# Altium schematic sheet [6] AnalogChannels_5_6_7_8.SchDoc: =DocumentName
size A3; Organization: ORGANIZATION; Address1: R. Aprígio Veloso, 882, Universitário; Address2: Campina Grande - PB; Address3: 58429-900; DocumentNumber: 6; Revision: -; SheetNumber: 6; SheetTotal: 8; ENG_DATE: --/--/--; DSN_DATE: --/--/--; CHK_DATE: --/--/--; SCH_SCALE: 1:1
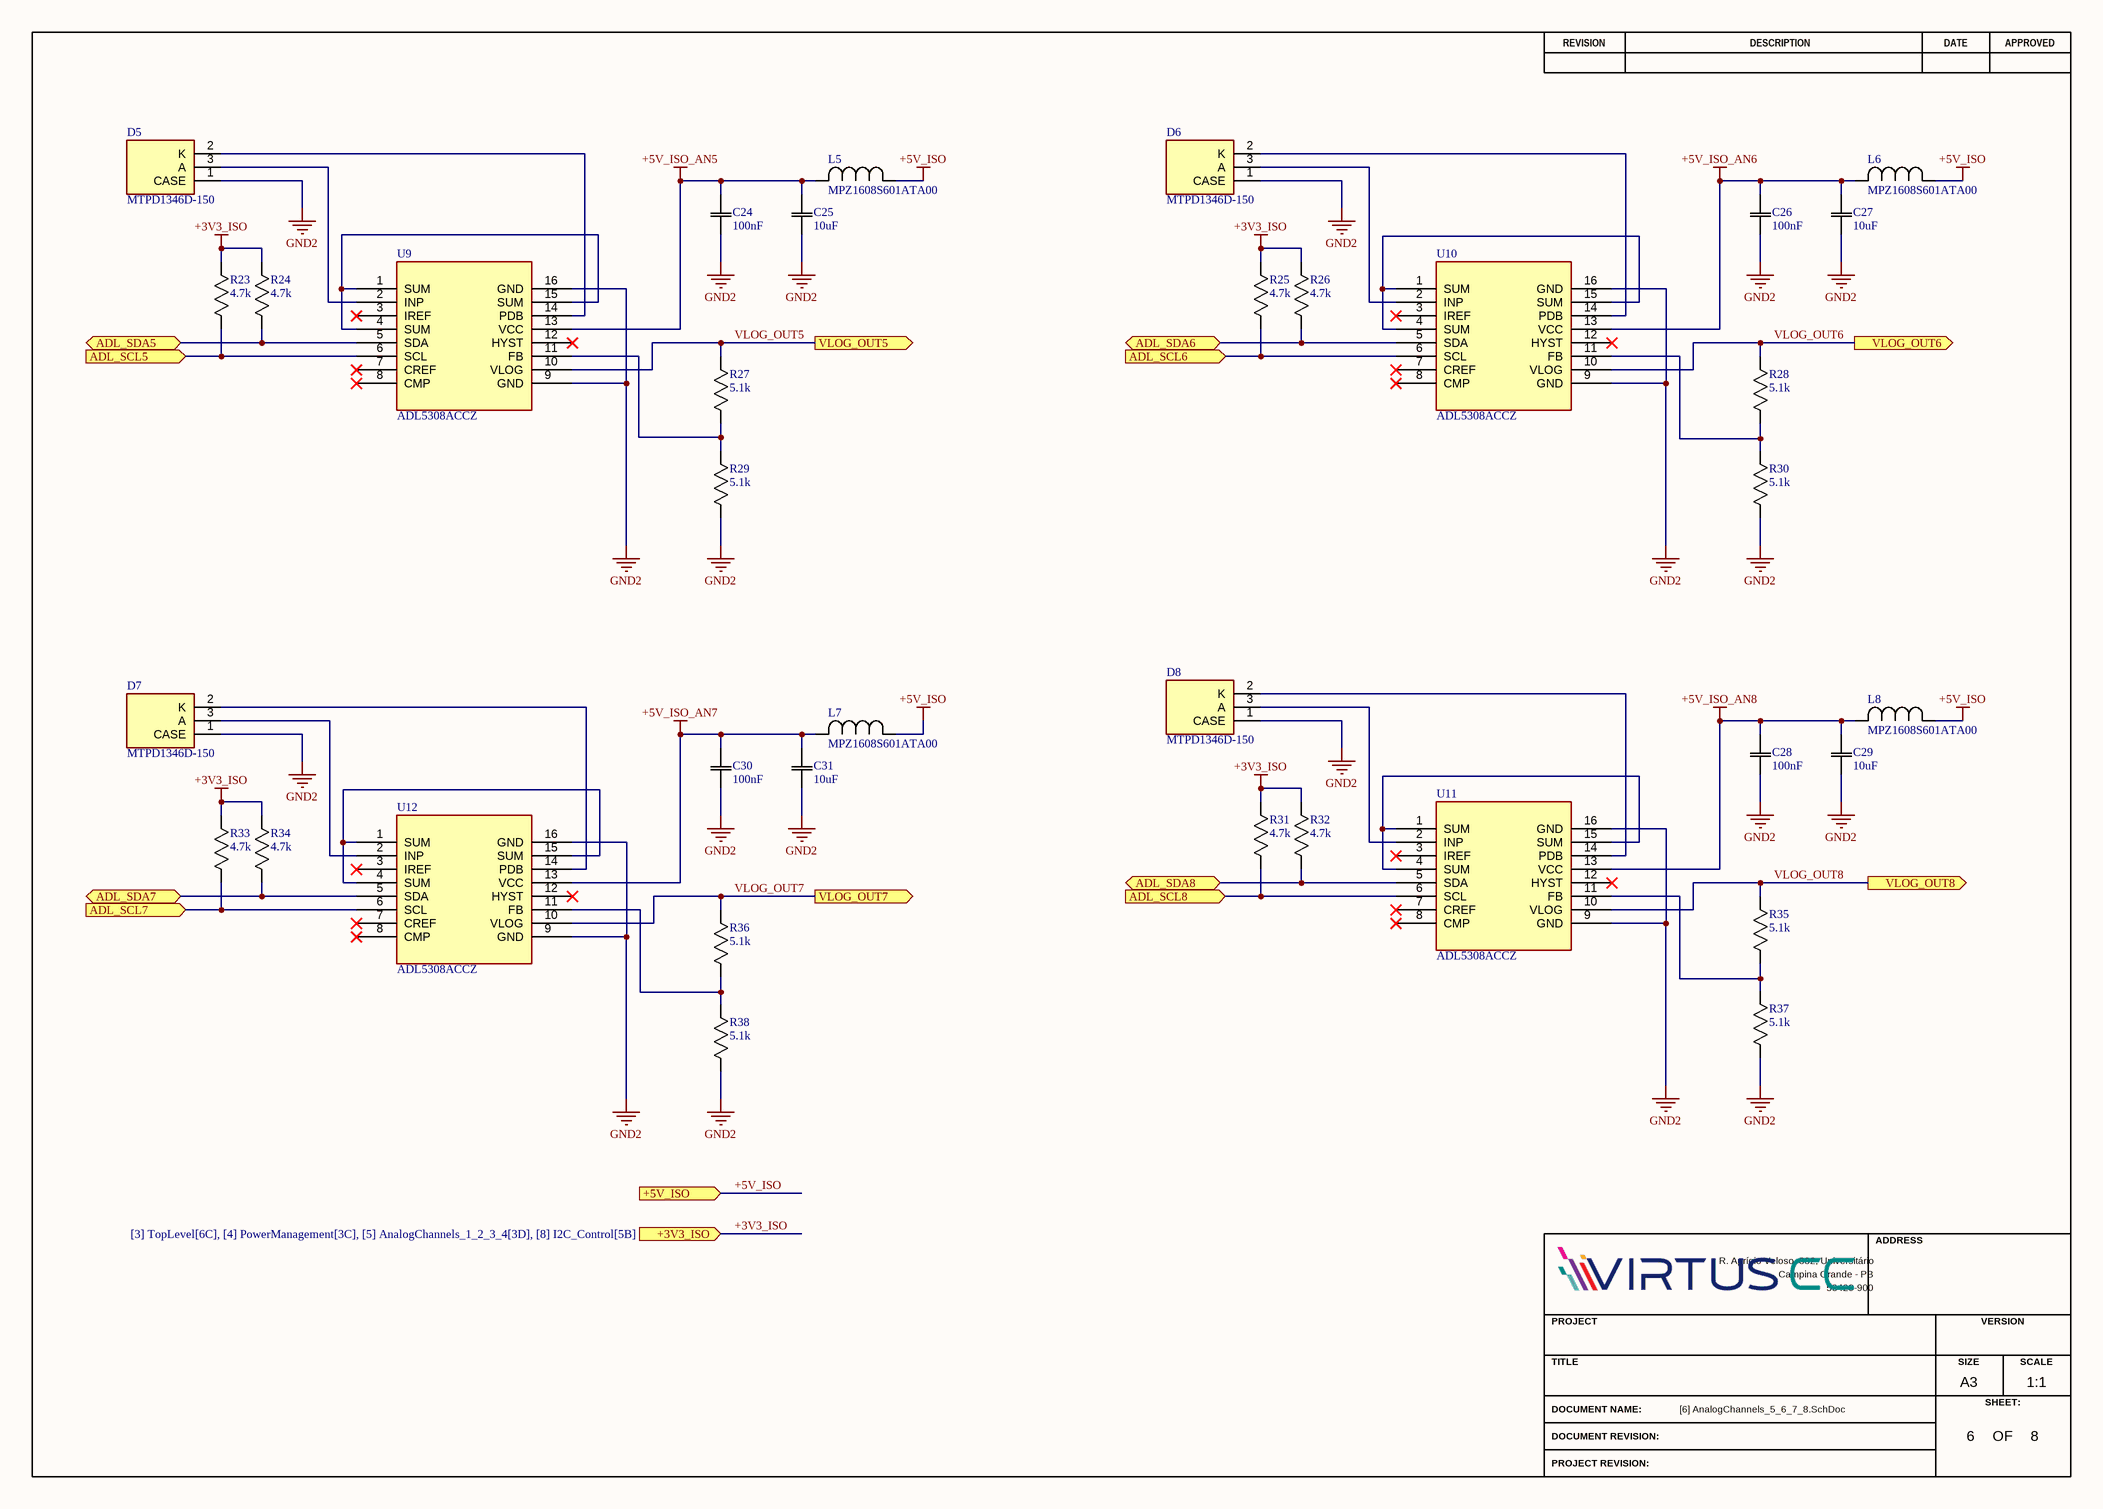
[diagram p0: [6] AnalogChannels_5_6_7_8.SchDoc]

## Parts
C24  value 100nF  [CAPC1005X40N]  (hidden comment: GCM155R71H104KE02D)
C25  value 10uF  [CAPC1005X40N]  (hidden comment: GRT155R61A106ME13D)
C26  value 100nF  [CAPC1005X40N]  (hidden comment: GCM155R71H104KE02D)
C27  value 10uF  [CAPC1005X40N]  (hidden comment: GRT155R61A106ME13D)
C28  value 100nF  [CAPC1005X40N]  (hidden comment: GCM155R71H104KE02D)
C29  value 10uF  [CAPC1005X40N]  (hidden comment: GRT155R61A106ME13D)
C30  value 100nF  [CAPC1005X40N]  (hidden comment: GCM155R71H104KE02D)
C31  value 10uF  [CAPC1005X40N]  (hidden comment: GRT155R61A106ME13D)
D5  MTPD1346D-150  [TO127P540X1680-3N]
D6  MTPD1346D-150  [TO127P540X1680-3N]
D7  MTPD1346D-150  [TO127P540X1680-3N]
D8  MTPD1346D-150  [TO127P540X1680-3N]
L5  MPZ1608S601ATA00  [INDC1608X06N]
L6  MPZ1608S601ATA00  [INDC1608X06N]
L7  MPZ1608S601ATA00  [INDC1608X06N]
L8  MPZ1608S601ATA00  [INDC1608X06N]
R23  value 4.7k  [RESC1005X40N]  (hidden comment: RC0402FR-074K7L)
R24  value 4.7k  [RESC1005X40N]  (hidden comment: RC0402FR-074K7L)
R25  value 4.7k  [RESC1005X40N]  (hidden comment: RC0402FR-074K7L)
R26  value 4.7k  [RESC1005X40N]  (hidden comment: RC0402FR-074K7L)
R27  value 5.1k  [RESC1005X40N]  (hidden comment: RC0402FR-075K1L)
R28  value 5.1k  [RESC1005X40N]  (hidden comment: RC0402FR-075K1L)
R29  value 5.1k  [RESC1005X40N]  (hidden comment: RC0402FR-075K1L)
R30  value 5.1k  [RESC1005X40N]  (hidden comment: RC0402FR-075K1L)
R31  value 4.7k  [RESC1005X40N]  (hidden comment: RC0402FR-074K7L)
R32  value 4.7k  [RESC1005X40N]  (hidden comment: RC0402FR-074K7L)
R33  value 4.7k  [RESC1005X40N]  (hidden comment: RC0402FR-074K7L)
R34  value 4.7k  [RESC1005X40N]  (hidden comment: RC0402FR-074K7L)
R35  value 5.1k  [RESC1005X40N]  (hidden comment: RC0402FR-075K1L)
R36  value 5.1k  [RESC1005X40N]  (hidden comment: RC0402FR-075K1L)
R37  value 5.1k  [RESC1005X40N]  (hidden comment: RC0402FR-075K1L)
R38  value 5.1k  [RESC1005X40N]  (hidden comment: RC0402FR-075K1L)
U9  ADL5308ACCZ  [CC-14-4_ADI]
U10  ADL5308ACCZ  [CC-14-4_ADI]
U11  ADL5308ACCZ  [CC-14-4_ADI]
U12  ADL5308ACCZ  [CC-14-4_ADI]

## Ports
+3V3_ISO (in, see [3] TopLevel[6C], [4] PowerManagement[3C], [5] AnalogChannels_1_2_3_4[3D], [8] I2C_Control[5B]), +5V_ISO (in, see [3] TopLevel[6C], [4] PowerManagement[4B], [5] AnalogChannels_1_2_3_4[3D]), ADL_SCL5 (in, see [3] TopLevel[6C], [8] I2C_Control[5B]), ADL_SCL6 (in, see [3] TopLevel[6C], [8] I2C_Control[5B]), ADL_SCL7 (in, see [3] TopLevel[6C], [8] I2C_Control[5B]), ADL_SCL8 (in, see [3] TopLevel[6C], [8] I2C_Control[5A]), ADL_SDA5 (bidir, see [3] TopLevel[6C], [8] I2C_Control[5B]), ADL_SDA6 (bidir, see [3] TopLevel[6C], [8] I2C_Control[5B]), ADL_SDA7 (bidir, see [3] TopLevel[6C], [8] I2C_Control[5B]), ADL_SDA8 (bidir, see [3] TopLevel[6C], [8] I2C_Control[5B]), VLOG_OUT5 (out, see [3] TopLevel[7C], [7] ADC_Acquisition[3A]), VLOG_OUT6 (out, see [3] TopLevel[7C], [7] ADC_Acquisition[3A]), VLOG_OUT7 (out, see [3] TopLevel[7C], [7] ADC_Acquisition[3A]), VLOG_OUT8 (out, see [3] TopLevel[7C], [7] ADC_Acquisition[3B])

## Nets
+3V3_ISO: R23.1 R24.1 R25.1 R26.1 R31.1 R32.1 R33.1 R34.1 ; port +3V3_ISO
+5V_ISO: L5.1 L6.1 L7.1 L8.1 ; port +5V_ISO
+5V_ISO_AN5: C24.2 C25.2 L5.2 U9.13(VCC)
+5V_ISO_AN6: C26.2 C27.2 L6.2 U10.13(VCC)
+5V_ISO_AN7: C30.2 C31.2 L7.2 U12.13(VCC)
+5V_ISO_AN8: C28.2 C29.2 L8.2 U11.13(VCC)
GND2: C24.1 C25.1 C26.1 C27.1 C28.1 C29.1 C30.1 C31.1 D5.1(CASE) D6.1(CASE) D7.1(CASE) D8.1(CASE) R29.2 R30.2 R37.2 R38.2 U9.9(GND) U9.16(GND) U10.9(GND) U10.16(GND) U11.9(GND) U11.16(GND) U12.9(GND) U12.16(GND)
ADL_SCL5: R23.2 U9.6(SCL) ; port ADL_SCL5
ADL_SCL6: R25.2 U10.6(SCL) ; port ADL_SCL6
ADL_SCL7: R33.2 U12.6(SCL) ; port ADL_SCL7
ADL_SCL8: R31.2 U11.6(SCL) ; port ADL_SCL8
ADL_SDA5: R24.2 U9.5(SDA) ; port ADL_SDA5
ADL_SDA6: R26.2 U10.5(SDA) ; port ADL_SDA6
ADL_SDA7: R34.2 U12.5(SDA) ; port ADL_SDA7
ADL_SDA8: R32.2 U11.5(SDA) ; port ADL_SDA8
VLOG_OUT5: R27.1 U9.10(VLOG) ; port VLOG_OUT5
VLOG_OUT6: R28.1 U10.10(VLOG) ; port VLOG_OUT6
VLOG_OUT7: R36.1 U12.10(VLOG) ; port VLOG_OUT7
VLOG_OUT8: R35.1 U11.10(VLOG) ; port VLOG_OUT8
NetD5_2: D5.2(K) U9.14(PDB)
NetD5_3: D5.3(A) U9.2(INP)
NetD6_2: D6.2(K) U10.14(PDB)
NetD6_3: D6.3(A) U10.2(INP)
NetD7_2: D7.2(K) U12.14(PDB)
NetD7_3: D7.3(A) U12.2(INP)
NetD8_2: D8.2(K) U11.14(PDB)
NetD8_3: D8.3(A) U11.2(INP)
NetR27_2: R27.2 R29.1 U9.11(FB)
NetR28_2: R28.2 R30.1 U10.11(FB)
NetR35_2: R35.2 R37.1 U11.11(FB)
NetR36_2: R36.2 R38.1 U12.11(FB)
NetU9_1: U9.1(SUM) U9.4(SUM) U9.15(SUM)
NetU10_1: U10.1(SUM) U10.4(SUM) U10.15(SUM)
NetU11_1: U11.1(SUM) U11.4(SUM) U11.15(SUM)
NetU12_1: U12.1(SUM) U12.4(SUM) U12.15(SUM)

Not connected (* = marked no-connect by the designer): U9 3(IREF)* 7(CREF)* 8(CMP)* 12(HYST)*; U10 3(IREF)* 7(CREF)* 8(CMP)* 12(HYST)*; U11 3(IREF)* 7(CREF)* 8(CMP)* 12(HYST)*; U12 3(IREF)* 7(CREF)* 8(CMP)* 12(HYST)*

## Notes on the sheet
- REVISION
- DESCRIPTION
- DATE
- APPROVED
- ADDRESS
- PROJECT
- VERSION
- TITLE
- A3
- SIZE
- SCALE
- DOCUMENT NAME:
- DOCUMENT REVISION:
- OF
- SHEET:
- PROJECT REVISION:

## Library data of the parts
C24 C26 C28 C30 = GCM155R71H104KE02D: 0.1 µF ±10% 50V Ceramic Capacitor X7R 0402 (1005 Metric); Manufacturer_Name: Murata; Copyright: Copyright (C) 2026 Ultra Librarian. All rights reserved.; Manufacturer_Part_Number: GCM155R71H104KE02D; Supplier 1: DigiKey; Supplier Part Number 1: 490-10672-1-ND; Datasheet Link: https://search.murata.co.jp/Ceramy/image/img/A01X/G101/ENG/GCM155R71H104KE02-01.pdf
C25 C27 C29 C31 = GRT155R61A106ME13D: 10 µF ±20% 10V Ceramic Capacitor X5R 0402 (1005 Metric); Manufacturer_Name: Murata; Copyright: Copyright (C) 2026 Ultra Librarian. All rights reserved.; Manufacturer_Part_Number: GRT155R61A106ME13D; Supplier 1: DigiKey; Supplier Part Number 1: 490-GRT155R61A106ME13DCT-ND; Datasheet Link: https://search.murata.co.jp/Ceramy/image/img/A01X/G101/ENG/GRT155R61A106ME13-01A.pdf
D5-D8 = MTPD1346D-150: Photodiode 1300nm TO-46-3 Lens Top Metal Can; Manufacturer_Name: Marktech Optoelectronics; SnapEDA_Link: https://www.snapeda.com/parts/MTPD1346D-150/Marktech%20Optoelectronics/view-part/2762424/?ref=snap; Value: MTPD1346D-150; Package: TO-46-3 Marktech Optoelectronics; Supplier 1: Digikey; Supplier Part Number 1: 1125-1327-ND; Manufacturer_Part_Number: MTPD1346D-150; Datasheet Link: https://specs.marktechopto.com/pdf/products/datasheet/MTPD1346D-150.pdf
L5-L8 = MPZ1608S601ATA00: INDUCTOR; SMT (0603); FERRITE-BEAD; 600; TOL=+/-25%; 1A; -55 DEGC TO +125 DEGC; Manufacturer_Name: TDK; Copyright: Copyright (C) 2026 Ultra Librarian. All rights reserved.; Manufacturer_Part_Number: MPZ1608S601ATA00; Supplier 1: DigiKey; Supplier Part Number 1: 445-MPZ1608S601ATA00CT-ND; Supplier 2: Mouser; Supplier Part Number 2: 810-MPZ1608S601ATA00; Value: MPZ1608S601ATA00; Datasheet Link: https://product.tdk.com/en/system/files/dam/doc/product/emc/emc/beads/catalog/beads_commercial_power_mpz1608_en.pdf
R23-R26 R31-R34 = RC0402FR-074K7L: 4.7 kOhms ±1% 0.063W, 1/16W Chip Resistor 0402 (1005 Metric) Moisture Resistant Thick Film; Manufacturer_Name: Yageo; Copyright: Copyright (C) 2025 Ultra Librarian. All rights reserved.; Manufacturer_Part_Number: RC0402FR-074K7L; Supplier: Digikey; Supplier 1: DigiKey; Supplier Part Number 1: 311-4.7KLRCT-ND; Datasheet Link: https://yageogroup.com/content/datasheet/asset/file/PYU-RC_GROUP_51_ROHS_L
R27-R30 R35-R38 = RC0402FR-075K1L: 5.1 kOhms ±1% 0.063W, 1/16W Chip Resistor 0402 (1005 Metric) Moisture Resistant Thick Film; Manufacturer_Name: Yageo; Copyright: Copyright (C) 2025 Ultra Librarian. All rights reserved.; Manufacturer_Part_Number: RC0402FR-075K1L; Supplier: Digikey; Supplier 1: DigiKey; Supplier Part Number 1: 311-5.10KLRDKR-ND; Datasheet Link: https://yageogroup.com/content/datasheet/asset/file/PYU-RC_GROUP_51_ROHS_L
U9-U12 = ADL5308ACCZ: Logarithmic Converter, 105Deg C, Lga-Ep Rohs Compliant: Yes |Analog Devices, Inc. ADL5308ACCZ; Supplier: DigiKey; Supplier Part Number: 505-ADL5308ACCZ-ND; Category: Integrated Circuits (ICs); ComponentLink1URL: https://octopart.com:443/opatz8j6/c1?t=RA9GQZinOd29-lgehR1mMjPVps_pwNRaRgVV1YHzAIV5tl_XZCUSSAHitgBUBAYOkyHWZwhmuKnJMJd5RxR1VqE6m3xnviegrgL6shNBcrpF4LfPbYQ25RAGHFA1T9s0JOT-tl-QhPVPfLuNoqTz_6GGuiJfIxRC0S7r0DYLo04TjJESfYEQgeF8hwJXvZVADboypZr_g-Ea1XOnqBF-rgke93XuIMELyUETblR1X_UOadx82_PQ_RlLZBBqxzR00efRp-5niCJZslCBmJMmtGL_WYk9XjRWZNLGIjLbjTB1vQWuYu6Ttro&src-supplier=Analog+Devices; ComponentLink1Description: https://octopart.com:443/opatz8j6/c1?t=RA9GQZinOd29-lgehR1mMjPVps_pwNRaRgVV1YHzAIV5tl_XZCUSSAHitgBUBAYOkyHWZwhmuKnJMJd5RxR1VqE6m3xnviegrgL6shNBcrpF4LfPbYQ25RAGHFA1T9s0JOT-tl-QhPVPfLuNoqTz_6GGuiJfIxRC0S7r0DYLo04TjJESfYEQgeF8hwJXvZVADboypZr_g-Ea1XOnqBF-rgke93XuIMELyUETblR1X_UOadx82_PQ_RlLZBBqxzR00efRp-5niCJZslCBmJMmtGL_WYk9XjRWZNLGIjLbjTB1vQWuYu6Ttro&src-supplier=Analog+Devices; ComponentLink2URL: http://sigma.octopart.com:80/conflict_mineral_statement/Analog-Devices-company-33.pdf?src-supplier=Compliance+Statements; ComponentLink2Description: http://sigma.octopart.com:80/conflict_mineral_statement/Analog-Devices-company-33.pdf?src-supplier=Compliance+Statements; ComponentLink3URL: https://octopart.com:443/opatz8j6/c1?t=vRyEE9f1knuZsXfZ1EXV0igJkx_-mJPvDe2PRj94G0bMKfSINrZLJy9UxvHag1Ev7-JZTv2yES3irMYFchBWTpWzSwFH9zvLS0b9JOrPs9Pp2SMp_5VkKg4D-b9XM9N4Wk1jNVgkSgkhW8YH7ZyvkiIcKE_oeD_Hqil2BcqMABFddqLYAoPEQj49TJ_q7pMpzWSP-EVr2GWpI1kmAhJOGILngaZVyGxqQjwZ-ZoOI0z0mJCfXwlyMjB28ReNlNurs-8EToiXecBFaJGtKdUbF4KCBm4bpE5gucx16B8aD2Bl3eu5--byB1E&src-supplier=Compliance+Statements; ComponentLink3Description: https://octopart.com:443/opatz8j6/c1?t=vRyEE9f1knuZsXfZ1EXV0igJkx_-mJPvDe2PRj94G0bMKfSINrZLJy9UxvHag1Ev7-JZTv2yES3irMYFchBWTpWzSwFH9zvLS0b9JOrPs9Pp2SMp_5VkKg4D-b9XM9N4Wk1jNVgkSgkhW8YH7ZyvkiIcKE_oeD_Hqil2BcqMABFddqLYAoPEQj49TJ_q7pMpzWSP-EVr2GWpI1kmAhJOGILngaZVyGxqQjwZ-ZoOI0z0mJCfXwlyMjB28ReNlNurs-8EToiXecBFaJGtKdUbF4KCBm4bpE5gucx16B8aD2Bl3eu5--byB1E&src-supplier=Compliance+Statements; Supplier 1: DigiKey; Supplier Part Number 1: 505-ADL5308ACCZ-ND; Manufacturer_Name: Analog Devices; Manufacturer_Part_Number: ADL5308ACCZ; Datasheet Link: https://www.analog.com/media/en/technical-documentation/data-sheets/adl5308.pdf; Value: ADL5308ACCZ